# EAGLE design ChristmasCards (EAGLE 5.09)
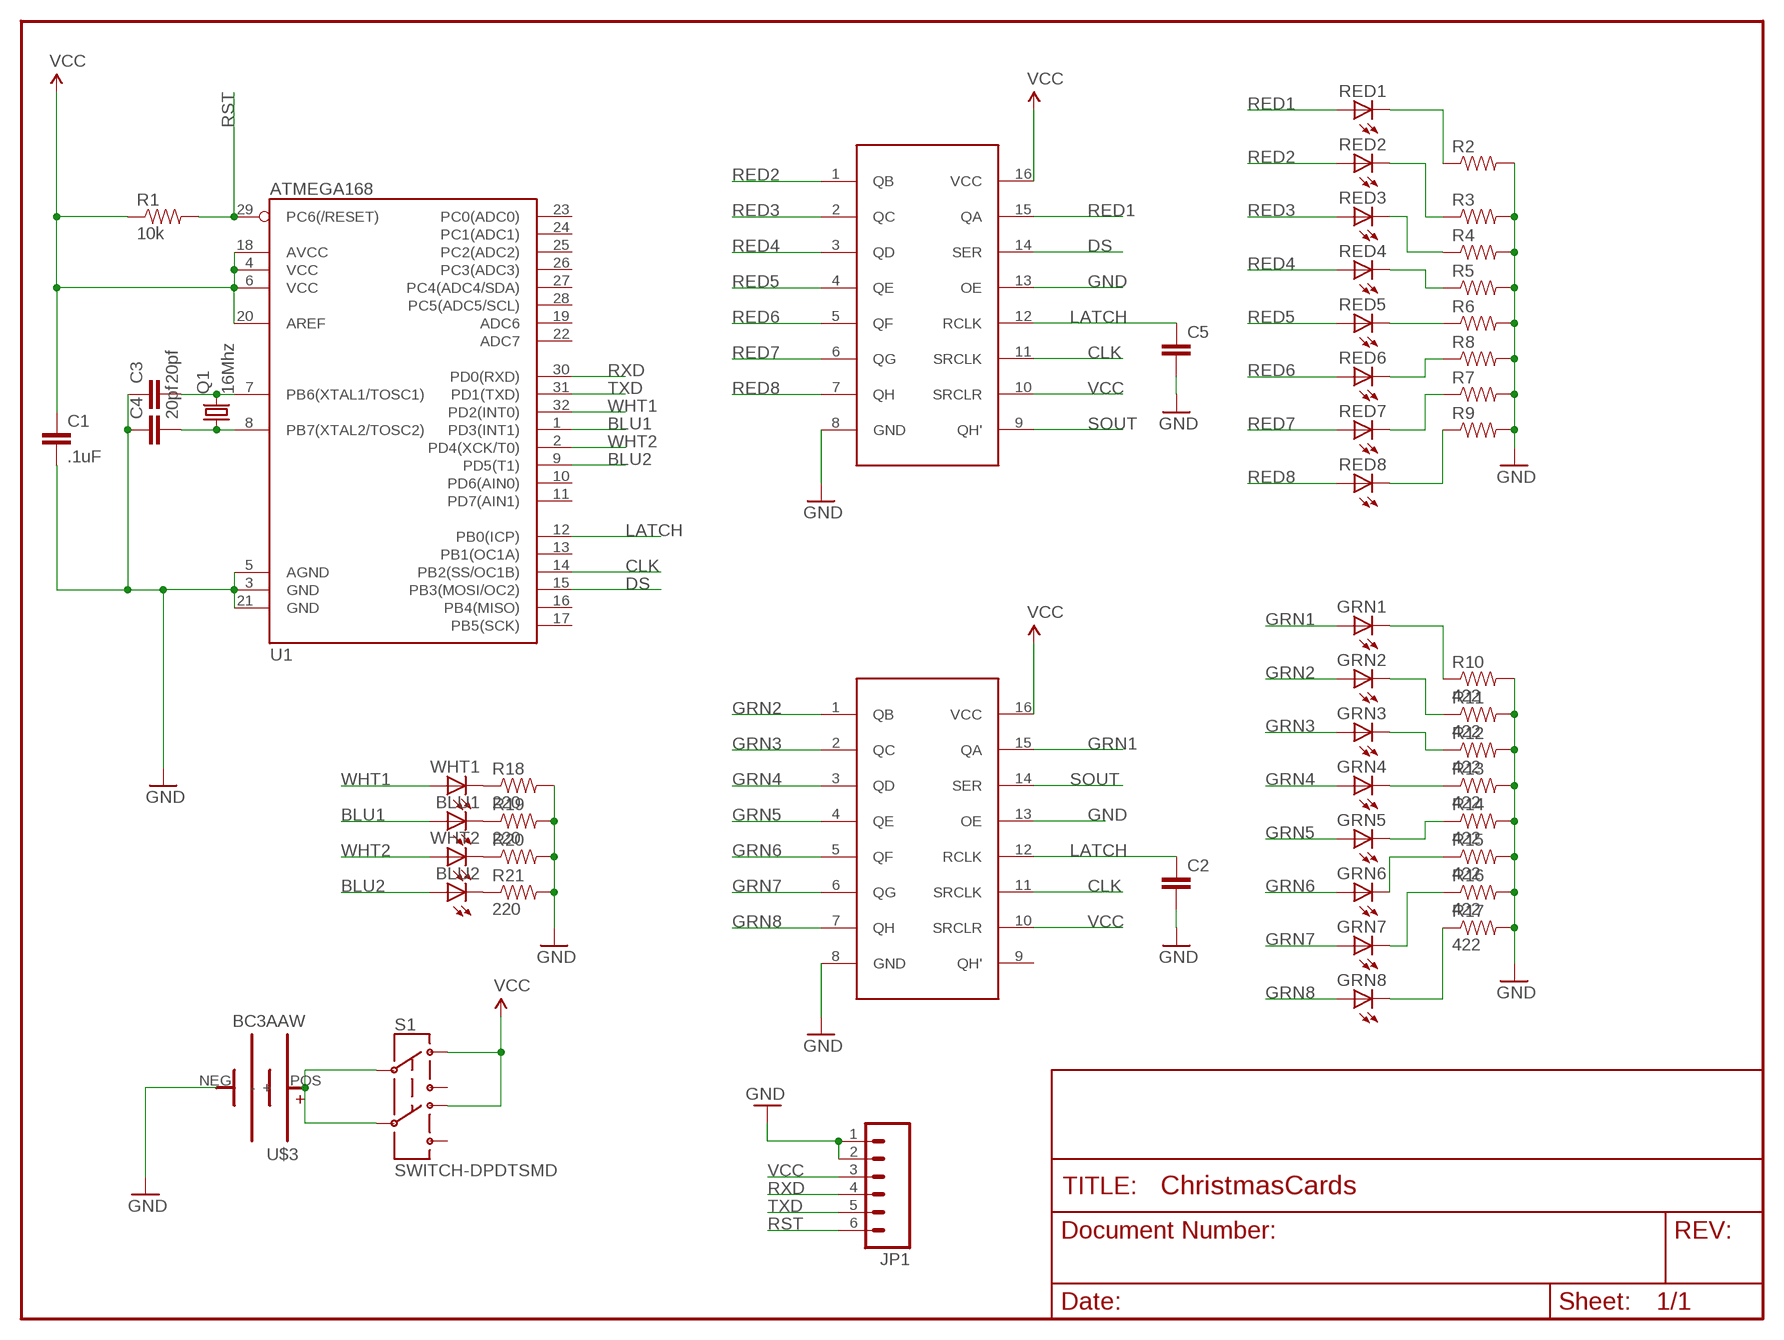
[diagram p0: schematic, sheet 1]

## Parts
BLU1  LED0603  [LED-0603]
BLU2  LED0603  [LED-0603]
C1  .1uF  CAP0805  [0805]
C2  CAP0805  [0805]
C3  20pf  CAP0603-CAP  [0603-CAP]
C4  20pf  CAP0603-CAP  [0603-CAP]
C5  CAP0805  [0805]
GRN1  LED0603  [LED-0603]
GRN2  LED0603  [LED-0603]
GRN3  LED0603  [LED-0603]
GRN4  LED0603  [LED-0603]
GRN5  LED0603  [LED-0603]
GRN6  LED0603  [LED-0603]
GRN7  LED0603  [LED-0603]
GRN8  LED0603  [LED-0603]
JP1  M06SIP  [1X06]
Q1  16Mhz  CRYSTAL5X3  [CRYSTAL-SMD-5X3]
R1  10k  RESISTOR  [0805]
R2  RESISTOR  [0805]
R3  RESISTOR  [0805]
R4  RESISTOR  [0805]
R5  RESISTOR  [0805]
R6  RESISTOR  [0805]
R7  RESISTOR  [0805]
R8  RESISTOR  [0805]
R9  RESISTOR  [0805]
R10  422  RESISTOR  [0805]
R11  422  RESISTOR  [0805]
R12  422  RESISTOR  [0805]
R13  422  RESISTOR  [0805]
R14  422  RESISTOR  [0805]
R15  422  RESISTOR  [0805]
R16  422  RESISTOR  [0805]
R17  422  RESISTOR  [0805]
R18  220  RESISTOR  [0805]
R19  220  RESISTOR  [0805]
R20  RESISTOR  [0805]
R21  220  RESISTOR  [0805]
RED1  LED0603  [LED-0603]
RED2  LED0603  [LED-0603]
RED3  LED0603  [LED-0603]
RED4  LED0603  [LED-0603]
RED5  LED0603  [LED-0603]
RED6  LED0603  [LED-0603]
RED7  LED0603  [LED-0603]
RED8  LED0603  [LED-0603]
S1  SWITCH-DPDTSMD  [AYZ0202]
U1  ATMEGA168  [TQFP32-08]
U$1  SN74HC595DR  [16-SOIC]
U$2  SN74HC595DR  [16-SOIC]
U$3  BC3AAW  [AABATTERYHOLDER]
U$4  MOTTO  [BECURIOUSMYSON]
U$5  CHRISTMAS2010SCRIPT  [CHRISTMAS2010]
WHT1  LED0603  [LED-0603]
WHT2  LED0603  [LED-0603]

## Nets
BLU1: BLU1.A U1.1(PD3(INT1))
BLU2: BLU2.A U1.9(PD5(T1))
CLK: U1.14(PB2(SS/OC1B)) U$1.11(SRCLK) U$2.11(SRCLK)
DS: U1.15(PB3(MOSI/OC2)) U$1.14(SER)
GND: C1.2 C2.2 C3.1 C4.1 C5.2 JP1.1 JP1.2 R2.2 R3.2 R4.2 R5.2 R6.2 R7.2 R8.2 R9.2 R10.2 R11.2 R12.2 R13.2 R14.2 R15.2 R16.2 R17.2 R18.2 R19.2 R20.2 R21.2 U1.3(GND) U1.5(AGND) U1.21(GND) U$1.8(GND) U$1.13(OE) U$2.8(GND) U$2.13(OE) U$3.NEG(-)
GRN1: GRN1.A U$2.15(QA)
GRN2: GRN2.A U$2.1(QB)
GRN3: GRN3.A U$2.2(QC)
GRN4: GRN4.A U$2.3(QD)
GRN5: GRN5.A U$2.4(QE)
GRN6: GRN6.A U$2.5(QF)
GRN7: GRN7.A U$2.6(QG)
GRN8: GRN8.A U$2.7(QH)
LATCH: C2.1 C5.1 U1.12(PB0(ICP)) U$1.12(RCLK) U$2.12(RCLK)
N$1: GRN6.C R15.1
N$2: S1.2 S1.5 U$3.POS(+)
N$5: C3.2 Q1.3 U1.7(PB6(XTAL1/TOSC1))
N$6: GRN7.C R16.1
N$7: C4.2 Q1.1 U1.8(PB7(XTAL2/TOSC2))
N$8: GRN8.C R17.1
N$9: GRN1.C R10.1
N$10: GRN2.C R11.1
N$11: GRN3.C R12.1
N$12: GRN4.C R13.1
N$13: GRN5.C R14.1
N$14: R2.1 RED1.C
N$15: R9.1 RED8.C
N$16: R7.1 RED7.C
N$17: R8.1 RED6.C
N$18: R6.1 RED5.C
N$19: R5.1 RED4.C
N$20: R4.1 RED3.C
N$21: R3.1 RED2.C
N$24: R18.1 WHT1.C
N$25: BLU1.C R19.1
N$26: R20.1 WHT2.C
N$27: BLU2.C R21.1
RED1: RED1.A U$1.15(QA)
RED2: RED2.A U$1.1(QB)
RED3: RED3.A U$1.2(QC)
RED4: RED4.A U$1.3(QD)
RED5: RED5.A U$1.4(QE)
RED6: RED6.A U$1.5(QF)
RED7: RED7.A U$1.6(QG)
RED8: RED8.A U$1.7(QH)
RST: JP1.6 R1.2 U1.29(PC6(/RESET))
RXD: JP1.4 U1.30(PD0(RXD))
SOUT: U$1.9(QH') U$2.14(SER)
TXD: JP1.5 U1.31(PD1(TXD))
VCC: C1.1 JP1.3 R1.1 S1.1 S1.4 U1.4(VCC) U1.6(VCC) U1.18(AVCC) U1.20(AREF) U$1.10(SRCLR) U$1.16(VCC) U$2.10(SRCLR) U$2.16(VCC)
WHT1: U1.32(PD2(INT0)) WHT1.A
WHT2: U1.2(PD4(XCK/T0)) WHT2.A
Unconnected: S1.3 S1.6 U1.10(PD6(AIN0)) U1.11(PD7(AIN1)) U1.13(PB1(OC1A)) U1.16(PB4(MISO)) U1.17(PB5(SCK)) U1.19(ADC6) U1.22(ADC7) U1.23(PC0(ADC0)) U1.24(PC1(ADC1)) U1.25(PC2(ADC2)) U1.26(PC3(ADC3)) U1.27(PC4(ADC4/SDA)) U1.28(PC5(ADC5/SCL)) U$2.9(QH')

## Library data of the parts
BLU1 BLU2 GRN1-GRN8 RED1-RED8 WHT1 WHT2 = SparkFun:LED: LEDs Standard schematic elements and footprints for 5mm, 3mm, 1206, and 0603 sized LEDs. 5mm - Spark Fun Electronics SKU : COM-00529 (and others)
C1-C5 = SparkFun:CAP: Capacitor Standard 0603 ceramic capacitor, and 0.1" leaded capacitor.
JP1 = SparkFun:M06: Header 6 Standard 6-pin 0.1" header. Use with straight break away headers (SKU : PRT-00116), right angle break away headers (PRT-00553), swiss pins (PRT-00743), machine pins (PRT-00117), and female headers (PRT-00115). Molex polarized connector foot print use with SKU : PRT-08094 with associated crimp pins and housings. NOTES ON THE VARIANTS LOCK and LOCK_LONGPADS... This footprint was designed to help hold the alignment of a through-hole component (i.e. 6-pin header) while soldering it into place. You may notice that each hole has been shifted either up or down by 0.005 of an inch from it's more standard position (which is a perfectly straight line). This slight alteration caused the pins (the squares in the middle) to touch the edges of the holes. Because they are alternating, it causes a "brace" to hold the component in place. 0.005 has proven to be the perfect amount of "off-center" position when using our standard breakaway headers. Although looks a little odd when you look at the bare footprint, once you have a header in there, the alteration is very hard to notice. Also, if you push a header all the way into place, it is covered up entirely on the bottom side. This idea of altering the position of holes to aid alignment will be further integrated into the Sparkfun Library for other footprints. It can help hold any component with 3 or more connection pins.
Q1 = SparkFun:CRYSTAL: Crystals Various standard crystals. Proven footprints. Spark Fun Electronics SKU : COM-00534
R1-R21 = SparkFun:RESISTOR: Resistor Basic schematic elements and footprints for 0603, 1206, and PTH 1/10th watt (small) resistors.
S1 = SparkFun:SWITCH-DPDT: DPDT Version of the COM-00597
U1 = SparkFun:ATMEGA168
U$1 U$2 = jaycollett:SN74HC595DR
U$3 = jaycollett:BC3AAW: AA Battery Holder (Wire Leads) MFG Part: BC3AAW (MPD Inc.)
U$4 = jaycollett:MOTTO
U$5 = jaycollett:CHRISTMAS2010SCRIPT

## Board
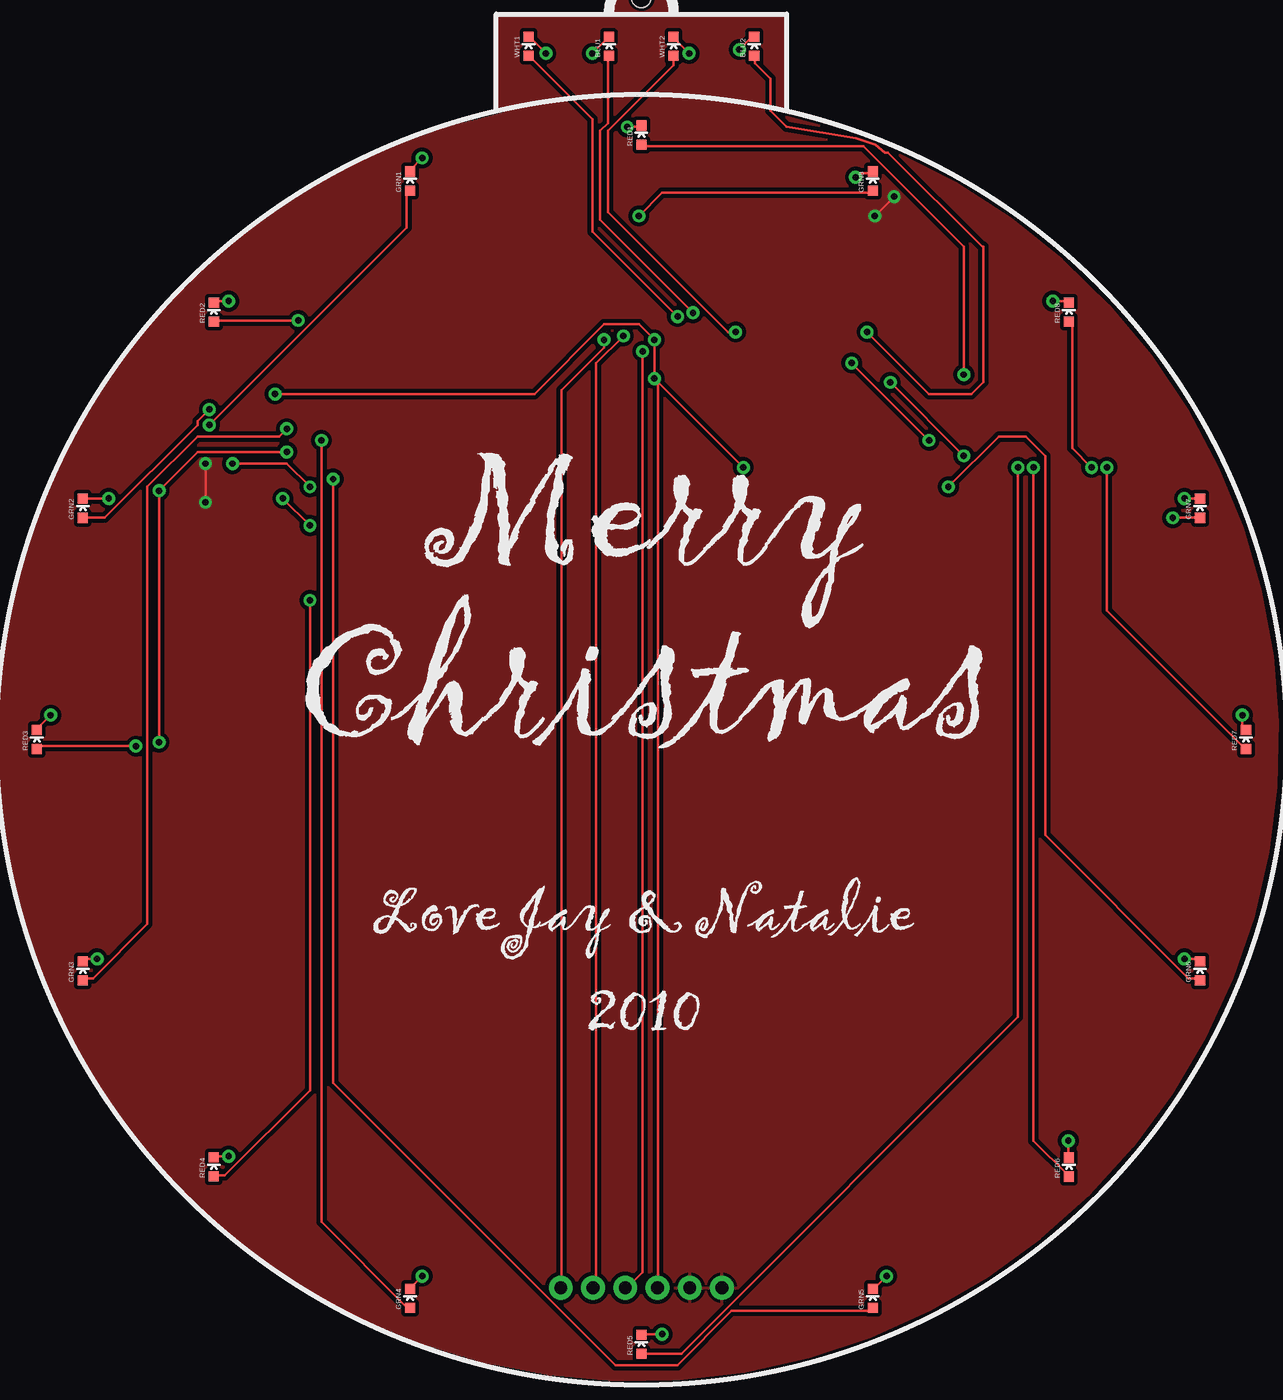
[diagram p1: board, top side]
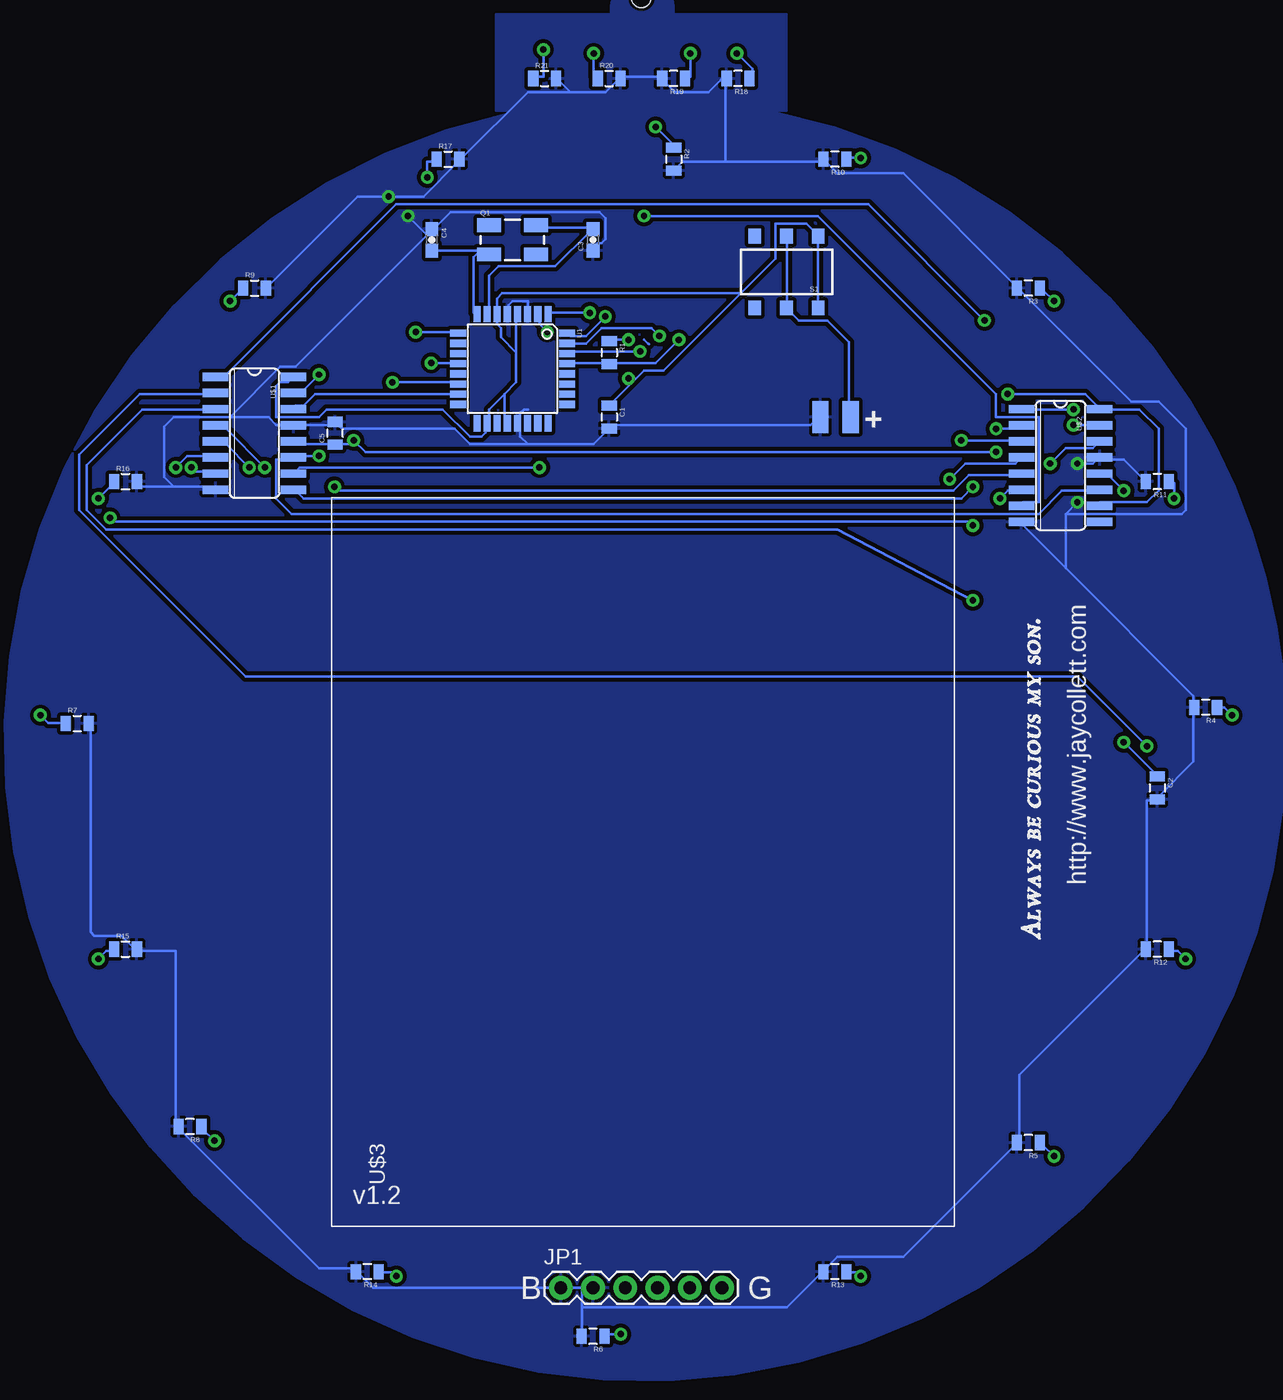
[diagram p2: board, bottom side, seen from below]

No outline drawn. Coordinates in mm, seen from the top.
Copper layers (1*16): Top 0.035mm / dielectric 1.5mm / Bottom 0.035mm
Design rules "SparkFun": minimum track width 8mil, minimum drill 20mil, track to track 8mil, track to pad 8mil, pad to pad 8mil, via to via 8mil, smd to smd 8mil, copper to edge 10mil, drill to drill 8mil, minimum pad ring 12mil, minimum via ring 10mil, stop-mask expansion 4mil, vias tented up to drill 25mil, thermal gap 10mil
Holes 1.52 mm at 50.8,109.22

### Footprints (pad centres in the part's own frame; a part is rotated, then mirrored left to right if it is on the bottom)
LED-0603 = smd 0.8 x 0.8: A 0,-0.75; C 0,0.75
0805 = smd 0.8 x 1.2: 1 -0.9,0; 2 0.9,0
0603-CAP = smd 1.1 x 1: 1 -0.85,0; 2 0.85,0
1X06 = drill 1.016 pad 1.88 round: 1 0,0; 2 2.54,0; 3 5.08,0; 4 7.62,0; 5 10.16,0; 6 12.7,0
CRYSTAL-SMD-5X3 = smd 1.9 x 1.1: 1 -1.85,-1.15; 2 1.85,-1.15; 3 1.85,1.15; 4 -1.85,1.15
AYZ0202 = smd 1 x 1.15: 1 -2.5,2.825; 2 0,2.825; 3 2.5,2.825; 4 -2.5,-2.825; 5 0,-2.825; 6 2.5,-2.825
TQFP32-08 = smd 1.27 x 0.559: 1 -4.293,2.8; 2 -4.293,2; 3 -4.293,1.2; 4 -4.293,0.4; 5 -4.293,-0.4; 6 -4.293,-1.2; 7 -4.293,-2; 8 -4.293,-2.8; 17 4.293,-2.8; 18 4.293,-2; 19 4.293,-1.2; 20 4.293,-0.4; 21 4.293,0.4; 22 4.293,1.2; 23 4.293,2; 24 4.293,2.8 | smd 0.559 x 1.27: 9 -2.8,-4.293; 10 -2,-4.293; 11 -1.2,-4.293; 12 -0.4,-4.293; 13 0.4,-4.293; 14 1.2,-4.293; 15 2,-4.293; 16 2.8,-4.293; 25 2.8,4.293; 26 2,4.293; 27 1.2,4.293; 28 0.4,4.293; 29 -0.4,4.293; 30 -1.2,4.293; 31 -2,4.293; 32 -2.8,4.293
16-SOIC = smd 0.66 x 2.032: 1 -4.445,-3.073; 2 -3.175,-3.073; 3 -1.905,-3.073; 4 -0.635,-3.073; 5 0.635,-3.073; 6 1.905,-3.073; 7 3.175,-3.073; 8 4.445,-3.073; 9 4.445,3.073; 10 3.175,3.073; 11 1.905,3.073; 12 0.635,3.073; 13 -0.635,3.073; 14 -1.905,3.073; 15 -3.175,3.073; 16 -4.445,3.073
AABATTERYHOLDER = smd 2.54 x 1.27: NEG 35.052,-13.97; POS 35.052,-16.358

### Placement (x,y rotation side)
BLU1  48.26,105.41 0 top
BLU2  59.69,105.41 0 top
C1  53.34,76.2 270 bottom
C2  10.16,46.99 270 bottom
C3  54.61,90.17 90 bottom
C4  67.31,90.17 270 bottom
C5  74.93,74.93 90 bottom
GRN1  32.58,94.8 0 top
GRN2  6.8,69.02 0 top
GRN3  6.8,32.58 0 top
GRN4  32.58,6.8 0 top
GRN5  69.02,6.8 0 top
GRN6  94.8,32.58 0 top
GRN7  94.8,69.02 0 top
GRN8  69.02,94.8 0 top
JP1  57.15,7.62 0 bottom
Q1  60.96,90.17 0 bottom
R1  53.34,81.28 270 bottom
R2  48.26,96.52 270 bottom
R3  20.32,86.36 180 bottom
R4  6.35,53.34 180 bottom
R5  20.32,19.05 180 bottom
R6  54.61,3.81 180 bottom
R7  95.25,52.07 0 bottom
R8  86.36,20.32 180 bottom
R9  81.28,86.36 0 bottom
R10  35.56,96.52 180 bottom
R11  10.16,71.12 180 bottom
R12  10.16,34.29 180 bottom
R13  35.56,8.89 180 bottom
R14  72.39,8.89 180 bottom
R15  91.44,34.29 0 bottom
R16  91.44,71.12 0 bottom
R17  66.04,96.52 0 bottom
R18  43.18,102.87 180 bottom
R19  48.26,102.87 180 bottom
R20  53.34,102.87 0 bottom
R21  58.42,102.87 0 bottom
RED1  50.8,98.42 0 top
RED2  17.12,84.48 0 top
RED3  3.17,50.8 0 top
RED4  17.11,17.14 0 top
RED5  50.8,3.17 0 top
RED6  84.48,17.12 0 top
RED7  98.42,50.8 0 top
RED8  84.48,84.48 0 top
S1  39.37,87.63 180 bottom
U1  60.96,80.01 270 bottom
U$1  81.28,74.93 270 bottom
U$2  17.78,72.39 270 bottom
U$3  50.67,41.15 90 bottom
U$4  18.92,35.05 90 bottom
U$5  33.02,29.21 0 top
WHT1  41.91,105.41 0 top
WHT2  53.34,105.41 0 top

### Tracks (layer width: path | path; a pad name or v marks a point on that pad's centre or on a via)
BLU1  (via drill 0.51)
  Top 0.203: v54.86,84.43 47.55,91.75 47.55,98.75 48.16,99.36 48.16,104.55 BLU1.A
  Bottom 0.203: v54.86,84.43 57.91,84.43 U1.1
BLU2  (via drill 0.51)
  Top 0.203: 59.44,104.55 BLU2.A 59.74,104.55 59.74,104.09 60.96,102.87 60.96,100.33 62.23,99.06 67.69,98.17 69.22,97.66 69.98,97.03 70.23,97.03 77.72,89.53 | 77.72,89.53 77.72,78.94 76.81,78.03 73.46,78.03 v68.58,82.91 | 77.72,89.53 77.72,89.61
  Bottom 0.203: v68.58,82.91 65.53,82.91 U1.9
CLK  (via drill 0.51)
  Top 0.203: v76.2,73.15 v70.41,78.94
  Bottom 0.203: v70.41,78.94 65.53,78.94 U1.14 | v76.2,73.15 78.03,73.15 U$1.11 78.33,72.85 79.55,72.85 79.55,69.8 78.33,68.58 19.51,68.58 17.68,70.41 14.94,70.41 U$2.11
DS
  Bottom 0.203: 65.23,78.03 U1.15 65.53,78.03 76.5,78.03 77.42,77.11 78.03,77.11 U$1.14
GND  (via drill 0.51)
  Top 0.203: v16.46,69.49 v16.46,72.54 | v70.71,93.57 v69.19,92.05
  Bottom 0.203: C3.1 54.56,89.61 54.25,89.92 53.95,89.92 53.65,90.22 53.65,91.89 54.11,92.35 65.84,92.35 67.06,91.14 C4.1 | 87.63,70.71 84.43,70.71 U$1.8 | 87.63,70.71 90.22,70.71 90.53,71.02 R16.2 | U1.5 61.27,84.43 61.27,85.04 60.96,85.34 59.74,85.34 59.74,84.43 U1.3 59.74,84.12 | 59.74,74.07 54.56,74.07 53.34,75.29 C1.2 53.34,75.59 37.49,75.59 36.88,76.2 U$3.NEG | 59.74,74.07 60.35,74.68 60.35,75.59 U1.21 60.35,75.89 60.35,76.5 60.05,76.81 59.74,76.81 | 59.74,74.07 64.31,74.07 65.53,75.29 74.37,75.29 74.68,75.59 C5.2 74.98,75.59 78.03,75.59 U$1.13 78.33,75.59 79.55,75.59 80.16,76.2 83.21,76.2 | 83.21,76.2 87.63,76.2 88.39,75.44 88.39,71.48 87.63,70.71 | 67.67,90.53 78.03,80.16 79.25,80.16 83.21,76.2 | 67.67,90.53 67.36,90.83 C4.1 | 56.39,101.8 57.3,102.72 R21.2 | 56.39,101.8 53.65,101.8 52.73,102.72 R20.2 52.43,103.02 49.38,103.02 R19.2 49.07,102.72 48.16,101.8 45.52,101.8 44.55,102.77 | 56.39,101.8 59.74,101.8 64.92,96.62 R17.2 65.23,96.32 67.97,93.57 v70.71,93.57 73.15,93.57 80.16,86.56 R9.2 | 44.2,96.32 36.58,96.32 R10.2 36.27,96.32 35.36,95.4 30.18,95.4 21.34,86.56 R3.2 21.03,86.26 12.19,77.42 10.06,77.42 7.92,75.29 7.92,68.89 8.23,68.58 17.37,68.58 | 44.2,96.32 47.55,96.32 48.16,95.71 R2.2 | 44.2,96.32 44.2,102.72 | R11.2 11.28,71.32 12.8,72.85 14.63,72.85 U$2.13 14.94,72.85 15.24,72.54 v16.46,72.54 | 7.32,53.34 7.32,49.07 10.06,46.33 C2.2 10.36,46.02 10.97,46.02 10.97,34.44 R12.2 11.28,34.14 21.03,24.38 21.03,19.2 R5.2 21.34,18.9 30.18,10.06 35.36,10.06 36.27,9.14 R13.2 36.58,8.84 39.32,6.1 55.47,6.1 | 17.37,64.31 20.73,67.67 U$2.8 | 7.32,53.34 7.32,54.25 17.37,64.31
  Bottom 0.203: 7.32,53.34 R4.2 | 17.37,68.58 v16.46,69.49 | R7.2 94.18,51.82 94.18,35.64 93.9,35.36 91.75,35.36 90.83,34.44 R15.2 90.53,34.14 87.48,34.14 87.48,20.42 R8.2 87.17,20.12 76.2,9.14 73.46,9.14 R14.2 73.15,8.84 71.93,7.62 JP1.1 55.47,7.62 | 55.47,6.1 55.47,7.62 | 55.47,6.1 55.47,3.96 R6.2 | 55.47,7.62 JP1.2 54.86,7.62 | v69.19,92.05 67.67,90.53 | 67.67,90.53 C4.1 | 44.55,102.77 44.45,102.87 | 44.2,102.72 44.5,102.72 44.55,102.77 | 44.2,102.72 R18.2 | 17.37,64.31 17.37,68.58
  pour Bottom (isolate 0.305): 0,52.07 0,50.8 arc328 7.62,77.47 arc30
  pour Top (isolate 0.305): 0,52.07 0,50.8 arc328 7.62,77.47 arc30
  pour Top (isolate 0.305): 39.37,107.95 39.37,100.33 62.23,100.33 62.23,107.95
  pour Bottom (isolate 0.305): 39.37,107.95 39.37,100.33 62.23,100.33 62.23,107.95
  pour Top: 48.51,109.35 arc307 50.16,110.74 arc16
  pour Bottom: 48.51,109.35 arc307 50.16,110.74 arc16
GND1
  Bottom 0.203: 50.6,82.3 50.29,81.99 50.22,81.97
GRN1  (via drill 0.51)
  Top 0.203: v16.76,75.59 32.31,91.14 32.31,93.88 GRN1.A
  Bottom 0.203: v16.76,75.59 14.94,75.59 U$2.15
GRN2  (via drill 0.51)
  Top 0.203: v16.76,76.81 15.85,75.89 15.85,75.59 8.53,68.28 7.01,68.28 GRN2.A
  Bottom 0.203: v16.76,76.81 20.73,76.81 U$2.1
GRN3  (via drill 0.51)
  Top 0.203: v22.86,75.29 22.25,74.68 15.85,74.68 11.89,70.71 11.89,36.27 7.62,32 7.01,32 GRN3.A
  Bottom 0.203: v22.86,75.29 21.03,75.29 U$2.2
GRN4  (via drill 0.51)
  Top 0.203: v25.6,74.37 25.6,12.8 32.31,6.1 GRN4.A
  Bottom 0.203: v25.6,74.37 21.03,74.37 U$2.3
GRN5  (via drill 0.51)
  Top 0.203: v26.52,71.32 26.52,23.77 48.77,1.52 53.65,1.52 57.91,5.79 68.89,5.79 GRN5.A
  Bottom 0.203: v26.52,71.32 25.3,72.54 21.34,72.54 U$2.4
GRN6  (via drill 0.51)
  Top 0.203: v74.98,70.71 78.94,74.68 81.08,74.68 82.6,73.15 82.6,43.28 93.88,32 94.79,32 GRN6.A
  Bottom 0.203: v74.98,70.71 74.68,70.41 26.21,70.41 24.99,71.63 21.03,71.63 U$2.5
GRN7  (via drill 0.51)
  Top 0.203: v92.66,68.28 GRN7.A | v22.55,69.8 v24.69,67.67
  Bottom 0.203: v92.66,68.28 92.35,67.97 24.99,67.97 v24.69,67.67 | v22.55,69.8 21.95,70.41 21.03,70.41 U$2.6
GRN8  (via drill 0.51)
  Top 0.203: v50.6,92.05 52.43,93.88 68.89,93.88 GRN8.A
  Bottom 0.203: v50.6,92.05 36.88,92.05 22.86,78.03 22.86,76.2 19.51,76.2 19.51,69.49 20.73,69.49 U$2.7
LATCH  (via drill 0.51)
  Top 0.203: v73.46,74.37 v67.36,80.47 | v12.8,50.6 v12.8,70.41 15.85,73.46 v22.86,73.46
  Bottom 0.203: U$1.12 78.03,74.07 74.98,74.07 C5.1 74.68,74.07 73.76,74.07 v73.46,74.37 72.54,73.46 v22.86,73.46 | v67.36,80.47 65.53,80.47 U1.12 | v12.8,50.6 10.36,48.16 C2.1 | v12.8,70.41 14.02,71.63 14.63,71.63 U$2.12
N$1  (via drill 0.51)
  Top 0.203: v93.57,33.53 94.79,33.53 GRN6.C
  Bottom 0.203: v93.57,33.53 92.96,34.14 92.35,34.14 R15.1
N$2
  Bottom 0.203: S1.5 39.32,90.22 39.32,85.04 S1.2 39.32,84.73 38.41,83.82 36.13,83.82 34.44,82.13 34.44,76.2 U$3.POS
N$5
  Bottom 0.203: Q1.3 58.83,91.14 54.86,91.14 C3.2 54.86,90.83 57.61,88.09 62.07,88.09 62.79,87.36 62.79,84.43 U1.7
N$6  (via drill 0.51)
  Top 0.203: v93.57,69.8 94.79,69.8 GRN7.C
  Bottom 0.203: v93.57,69.8 92.35,71.02 R16.1
N$7
  Bottom 0.203: 63.5,89.31 63.09,89.31 Q1.1 | 63.5,89.31 67.06,89.31 C4.2 | U1.8 64.01,84.43 64.01,88.8 63.5,89.31
N$8  (via drill 0.51)
  Top 0.203: v67.67,95.1 67.97,95.4 68.89,95.4 GRN8.C
  Bottom 0.203: v67.67,95.1 67.67,96.32 67.06,96.32 R17.1
N$9  (via drill 0.51)
  Top 0.203: v33.53,96.62 32.61,95.71 GRN1.C
  Bottom 0.203: v33.53,96.62 34.44,96.62 R10.1
N$10  (via drill 0.51)
  Top 0.203: v8.84,69.8 7.01,69.8 GRN2.C
  Bottom 0.203: v8.84,69.8 8.84,71.02 9.14,71.02 R11.1
N$11  (via drill 0.51)
  Top 0.203: v7.92,33.53 7.01,33.53 GRN3.C
  Bottom 0.203: v7.92,33.53 8.53,34.14 9.14,34.14 R12.1
N$12  (via drill 0.51)
  Top 0.203: v33.53,8.53 32.61,7.62 GRN4.C
  Bottom 0.203: v33.53,8.53 33.83,8.84 34.44,8.84 R13.1
N$13  (via drill 0.51)
  Top 0.203: v70.1,8.53 69.19,7.62 GRN5.C
  Bottom 0.203: v70.1,8.53 70.41,8.84 71.32,8.84 R14.1
N$14  (via drill 0.51)
  Top 0.203: v49.68,99.06 50.6,99.06 RED1.C
  Bottom 0.203: v49.68,99.06 48.16,97.54 R2.1
N$15  (via drill 0.51)
  Top 0.203: v83.21,85.34 84.43,85.34 RED8.C
  Bottom 0.203: v83.21,85.34 82.3,86.26 R9.1
N$16  (via drill 0.51)
  Top 0.203: v98.15,52.73 98.15,51.82 RED7.C
  Bottom 0.203: v98.15,52.73 97.54,52.12 96.32,52.12 R7.1
N$17  (via drill 0.51)
  Top 0.203: v84.43,19.2 84.43,17.98 RED6.C
  Bottom 0.203: v84.43,19.2 85.34,20.12 R8.1
N$18  (via drill 0.51)
  Top 0.203: v52.43,3.96 50.9,3.96 RED5.C
  Bottom 0.203: v52.43,3.96 53.65,3.96 R6.1
N$19  (via drill 0.51)
  Top 0.203: v18.29,17.98 17.37,17.98 RED4.C
  Bottom 0.203: v18.29,17.98 19.2,18.9 R5.1
N$20  (via drill 0.51)
  Top 0.203: v4.27,52.73 3.35,51.82 RED3.C
  Bottom 0.203: v4.27,52.73 4.88,53.34 R4.1
N$21  (via drill 0.51)
  Top 0.203: v18.29,85.34 17.37,85.34 RED2.C
  Bottom 0.203: v18.29,85.34 19.2,86.26 R3.1
N$24  (via drill 0.51)
  Top 0.203: v43.28,104.85 42.06,106.07 WHT1.C
  Bottom 0.203: v43.28,104.85 42.06,103.63 42.06,103.02 R18.1
N$25  (via drill 0.51)
  Top 0.203: v46.94,104.85 48.16,106.07 BLU1.C
  Bottom 0.203: v46.94,104.85 46.94,103.02 47.24,103.02 R19.1
N$26  (via drill 0.51)
  Top 0.203: v54.56,104.85 53.34,106.07 WHT2.C
  Bottom 0.203: v54.56,104.85 54.56,103.02 54.25,103.02 R20.1
N$27  (via drill 0.51)
  Top 0.203: v58.52,105.16 59.44,106.07 BLU2.C
  Bottom 0.203: v58.52,105.16 58.52,103.02 59.13,103.02 R21.1
RED1  (via drill 0.51)
  Top 0.203: v76.2,79.55 76.2,89.61 68.28,97.54 50.9,97.54 RED1.A
  Bottom 0.203: v76.2,79.55 77.42,78.33 78.03,78.33 U$1.15
RED2  (via drill 0.51)
  Top 0.203: v23.77,83.82 17.37,83.82 RED2.A
  Bottom 0.203: v23.77,83.82 32.92,92.96 70.1,92.96 83.52,79.55 84.12,79.55 U$1.1
RED3  (via drill 0.51)
  Top 0.203: v10.97,50.29 3.35,50.29 RED3.A
  Bottom 0.203: v10.97,50.29 16.46,55.78 81.99,55.78 95.1,68.89 95.1,73.23 90.3,78.03 84.43,78.03 U$1.2
RED4  (via drill 0.51)
  Top 0.203: v24.69,61.77 24.69,23.16 17.98,16.46 17.37,16.46 RED4.A
  Bottom 0.203: v24.69,61.77 35.36,67.36 92.96,67.36 94.49,68.89 94.49,72.43 90.11,76.81 84.43,76.81 U$1.3
RED5  (via drill 0.51)
  Top 0.203: v80.47,72.24 80.47,28.96 53.95,2.44 50.9,2.44 RED5.A
  Bottom 0.203: v80.47,72.24 83.52,75.29 84.12,75.29 U$1.4
RED6  (via drill 0.51)
  Top 0.203: v81.69,72.24 81.69,19.2 84.43,16.46 RED6.A
  Bottom 0.203: v81.69,72.24 83.52,74.07 84.12,74.07 U$1.5
RED7  (via drill 0.51)
  Top 0.203: v87.48,72.24 87.48,60.96 98.15,50.29 RED7.A
  Bottom 0.203: v87.48,72.24 86.56,73.15 84.43,73.15 U$1.6
RED8  (via drill 0.51)
  Top 0.203: v86.26,72.24 84.73,73.76 84.73,83.52 RED8.A
  Bottom 0.203: v86.26,72.24 85.95,71.93 84.43,71.93 U$1.7
RST  (via drill 0.51)
  Top 0.203: v47.85,82.3 47.85,81.69 44.5,78.33 44.5,7.62 JP1.6
  Bottom 0.203: 53.34,80.47 56.39,80.47 U1.29 | 53.34,80.47 49.68,80.47 v47.85,82.3 | 53.34,80.47 R1.2
RXD  (via drill 0.51)
  Top 0.203: v50.9,81.38 50.9,8.84 49.68,7.62 JP1.4
  Bottom 0.203: v50.9,81.38 56.39,81.38 U1.30
SOUT  (via drill 0.51)
  Top 0.203: v18.59,72.54 22.86,72.54 v24.69,70.71
  Bottom 0.203: v18.59,72.54 17.37,73.76 15.24,73.76 U$2.14 | v24.69,70.71 25.6,69.8 77.42,69.8 78.03,70.41 U$1.9
TXD  (via drill 0.51)
  Top 0.203: v49.38,82.6 47.24,80.47 47.24,7.62 JP1.5
  Bottom 0.203: v49.38,82.6 49.99,83.21 53.95,83.21 55.17,81.99 56.39,81.99 U1.31
VCC  (via drill 0.51)
  Top 0.203: 52.12,78.94 v58.83,72.24 | 52.12,78.94 52.12,7.62 JP1.3 | 52.12,78.94 v51.82,79.25 v51.82,82.3 50.6,83.52 47.85,83.52 42.37,78.03 v21.95,78.03
  Bottom 0.203: U1.4 60.66,84.12 60.66,81.28 | U1.20 61.57,75.89 61.57,78.03 | U$1.16 78.64,78.94 79.25,78.94 79.55,78.64 79.55,76.2 76.2,76.2 75.59,76.81 66.45,76.81 64.31,74.68 63.4,74.68 63.09,74.98 63.09,75.59 U1.18 62.79,75.89 62.79,76.81 61.57,78.03 | U$2.10 14.63,69.49 10.97,69.49 10.06,70.41 10.06,75.31 11.56,76.81 14.63,76.81 U$2.16 14.94,77.11 15.85,78.03 v21.95,78.03 | S1.1 36.88,85.04 36.88,90.22 S1.4 36.88,90.53 37.8,91.44 40.23,91.44 40.23,88.7 42.98,85.95 | 51.51,78.94 50.6,79.86 49.07,79.86 42.98,85.95 | 51.51,78.94 53.34,77.11 C1.1 | v51.82,82.3 53.34,82.3 R1.1 | v51.82,79.25 51.51,78.94 | v58.83,72.24 77.72,72.24 U$1.10 | 42.98,85.95 61.77,85.95 62.18,85.54 62.18,84.43 U1.6 62.18,84.12 62.18,83.52 61.87,83.21 61.87,82.5 60.66,81.28 | 60.66,81.28 60.66,78.94 61.57,78.03
WHT1  (via drill 0.51)
  Top 0.203: v53.65,84.12 46.94,90.83 46.94,99.67 42.06,104.55 WHT1.A
  Bottom 0.203: v53.65,84.12 55.17,82.6 56.39,82.6 U1.32
WHT2  (via drill 0.51)
  Top 0.203: WHT2.A 53.34,103.94 48.16,98.75 48.16,92.35 57.61,82.91 v58.22,82.91
  Bottom 0.203: v58.22,82.91 58.83,83.52 58.83,84.12 U1.2

### Text on the board
bPlace: + | http://www.jaycollett.com | v1.2 | G | B